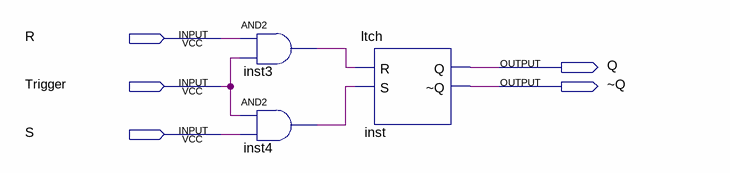
[diagram p0: schematic sheet]
// Quartus schematic ltchsr.bdf as structural Verilog: 3 symbols, 5 pins
module ltchsr (
  input  R,
  input  Trigger,
  input  S,
  output Q,
  output \~Q 
);

  wire inst3_out, inst4_out;

  and inst3 (inst3_out, R, Trigger);
  and inst4 (inst4_out, Trigger, S);
  ltch inst (.R(inst3_out), .S(inst4_out), .Q(Q), .\~Q (\~Q ));
endmodule
